# Altium project lora_tracker_altium.PrjPcb
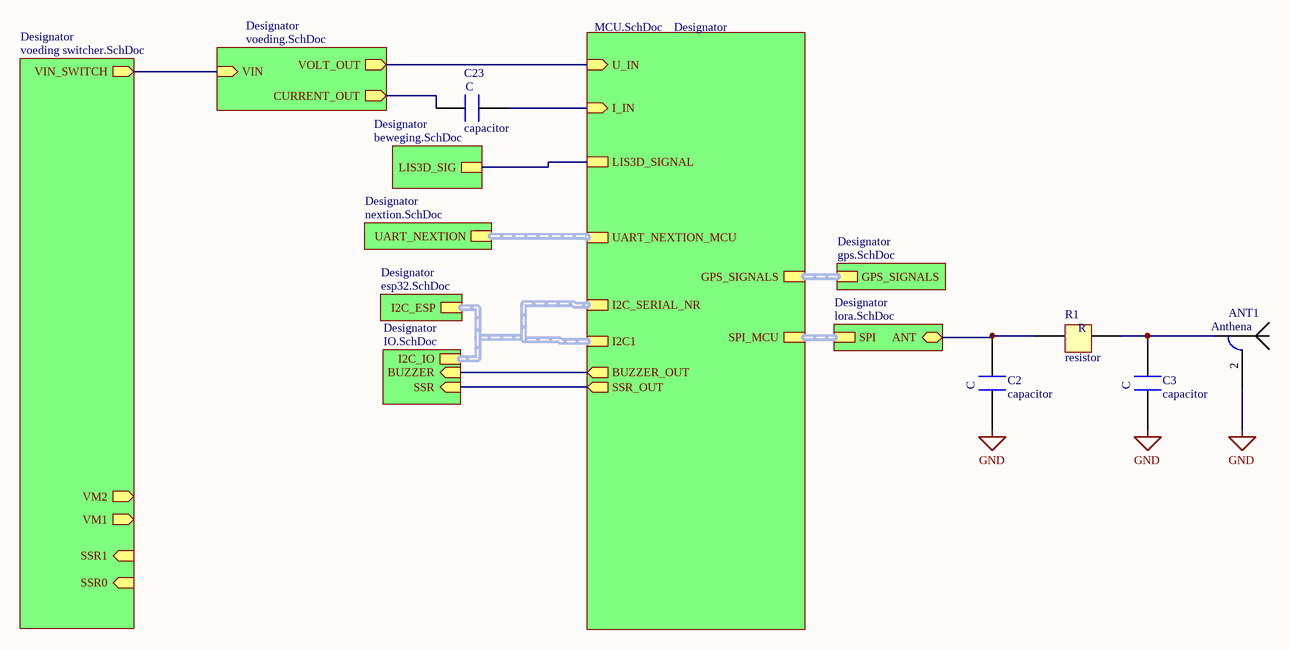
[diagram p0: top.SchDoc]
3 sheets, 21 parts. Net scope: hierarchical (ports join the sheet entries above them; power ports are global).
Board file: trackerpcb.PcbDoc
Sheets:
  top.SchDoc
    Designator = MCU.SchDoc
    Designator = voeding switcher.SchDoc

## Sheet top.SchDoc
size A4; Author: Ben De Lathouwer; CompanyName: Eurocircuits; DrawnBy: Ben De Lathouwer; SheetNumber: 1; SheetTotal: 8

### Parts
ANT1  Anthena  [sma connector]
C2  capacitor  [0603]
C3  capacitor  [0603]
C23  capacitor  [0603]
R1  resistor  [0603]

### Sub-sheets
Designator = voeding.SchDoc (file not in this document): VIN (in), VOLT_OUT (out), CURRENT_OUT (out)
Designator = beweging.SchDoc (file not in this document): LIS3D_SIG (harness LIS3D_SIGNAL)
Designator = IO.SchDoc (file not in this document): SSR (in), BUZZER (in), I2C_IO (harness I2C_SERIAL_NR)
Designator = gps.SchDoc (file not in this document): GPS_SIGNALS (harness GPS_SIGNALS)
Designator = esp32.SchDoc (file not in this document): I2C_ESP (harness I2C1)
Designator = lora.SchDoc (file not in this document): ANT (bidir), SPI (harness SPI)
Designator = nextion.SchDoc (file not in this document): UART_NEXTION (harness UART_NEXTION)
Designator = MCU.SchDoc: GPS_SIGNALS (harness GPS_SIGNALS), LIS3D_SIGNAL (harness LIS3D_SIGNAL), I2C_SERIAL_NR (harness I2C_SERIAL_NR), I2C1 (harness I2C1), SPI_MCU (harness SPI), UART_NEXTION_MCU (harness UART_NEXTION), I_IN (in), U_IN (in), SSR_OUT (out), BUZZER_OUT (out)
Designator = voeding switcher.SchDoc: VM2 (out), VM1 (out), SSR1 (in), SSR0 (in), VIN_SWITCH (out)

### Nets
GND: ANT1.2 C2.2 C3.2
Net*_4: sheet Designator/VIN, sheet Designator/VIN_SWITCH
NetANT1_1: ANT1.1 C3.1 R1.1
NetC2_1: C2.1 R1.2 ; sheet Designator/ANT
NetC23_1: C23.1 ; sheet Designator/I_IN
NetC23_2: C23.2 ; sheet Designator/CURRENT_OUT
NetU8_7: sheet Designator/VOLT_OUT, sheet Designator/U_IN
NetU8_14: sheet Designator/BUZZER, sheet Designator/BUZZER_OUT
NetU8_15: sheet Designator/SSR, sheet Designator/SSR_OUT

### Buses and harness runs
harness sheet Designator/I2C1 = sheet Designator/I2C_ESP = sheet Designator/I2C_IO = sheet Designator/I2C_SERIAL_NR
harness sheet Designator/SPI = sheet Designator/SPI_MCU
harness sheet Designator/UART_NEXTION = sheet Designator/UART_NEXTION_MCU

### Notes on the sheet
- (in symbol capacitor) C
- (in symbol resistor) R

## Sheet MCU.SchDoc
size A4; SheetNumber: 7; SheetTotal: 8
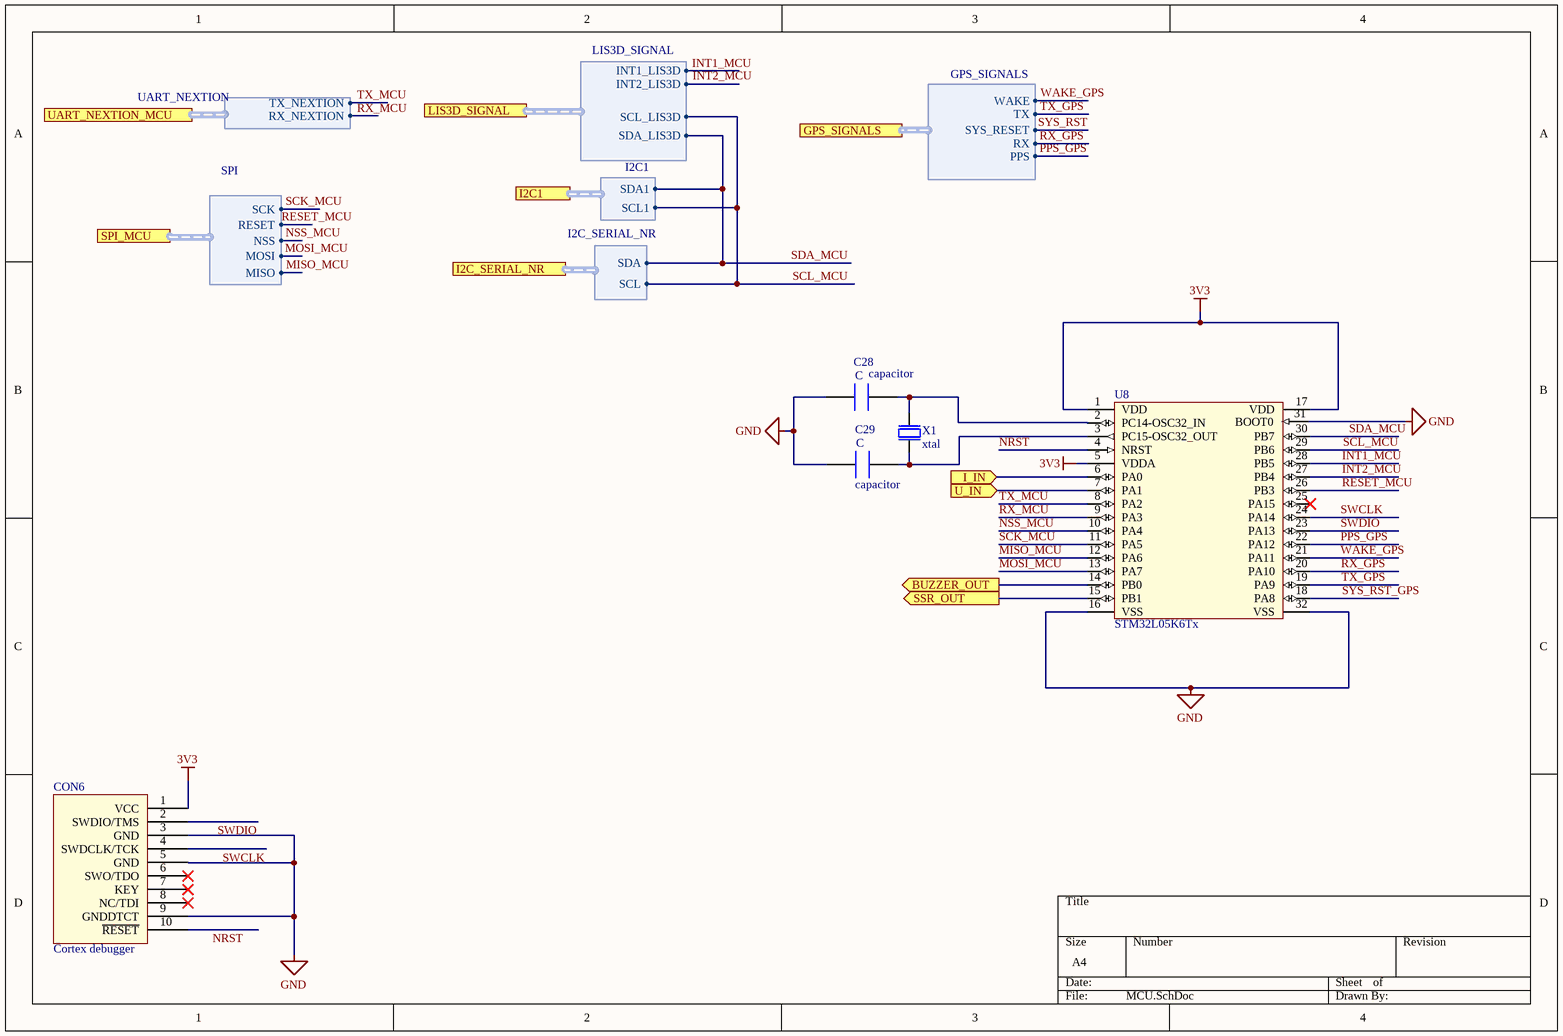
[diagram p1: MCU.SchDoc]

### Parts
C28  capacitor  [CAPC1005X04L]
C29  capacitor  [CAPC1005X04L]
CON6  Cortex debugger  [Jtag header]
U8  STM32L05K6Tx
X1  xtal  [BT-XTAL_2016]

### Ports
BUZZER_OUT (out), GPS_SIGNALS (harness GPS_SIGNALS), I2C1 (harness I2C1), I2C_SERIAL_NR (harness I2C_SERIAL_NR), I_IN (in), LIS3D_SIGNAL (harness LIS3D_SIGNAL), SPI_MCU (harness SPI), SSR_OUT (out), U_IN (in), UART_NEXTION_MCU (harness UART_NEXTION)

### Harnesses
UART_NEXTION: RX_NEXTION, TX_NEXTION
SPI: MISO, MOSI, NSS, RESET, SCK
LIS3D_SIGNAL: INT1_LIS3D, INT2_LIS3D, SCL_LIS3D, SDA_LIS3D
I2C1: SCL1, SDA1
I2C_SERIAL_NR: SCL, SDA
GPS_SIGNALS: PPS, RX, SYS_RESET, TX, WAKE

### Nets
3V3: CON6.1(VCC) U8.1(VDD) U8.5(VDDA) U8.17(VDD)
GND: C28.2 C29.2 CON6.3(GND) CON6.5(GND) CON6.9(GNDDTCT) U8.16(VSS) U8.31(BOOT0) U8.32(VSS)
INT1_MCU: U8.28(PB5)
INT2_MCU: U8.27(PB4) ; port LIS3D_SIGNAL.INT2_LIS3D
MISO_MCU: U8.12(PA6) ; port SPI_MCU.MISO
MOSI_MCU: U8.13(PA7) ; port SPI_MCU.MOSI
NRST: CON6.10(~{RESET}) U8.4(NRST)
NSS_MCU: U8.10(PA4) ; port SPI_MCU.NSS
PPS_GPS: U8.22(PA12) ; port GPS_SIGNALS.PPS
RESET_MCU: U8.26(PB3) ; port SPI_MCU.RESET
RX_GPS: U8.20(PA10) ; port GPS_SIGNALS.RX
RX_MCU: U8.9(PA3) ; harness UART_NEXTION.RX_NEXTION
SCK_MCU: U8.11(PA5) ; port SPI_MCU.SCK
SCL_MCU: U8.29(PB6) ; port LIS3D_SIGNAL.SCL_LIS3D, port I2C1.SCL1, port I2C1.SCL
SDA_MCU: U8.30(PB7) ; port LIS3D_SIGNAL.SDA_LIS3D, port I2C1.SDA1, port I2C1.SDA
SWCLK: CON6.4(SWDCLK/TCK) U8.24(PA14)
SWDIO: CON6.2(SWDIO/TMS) U8.23(PA13)
SYS_RST: port GPS_SIGNALS.SYS_RESET
SYS_RST_GPS: U8.18(PA8)
TX_GPS: U8.19(PA9) ; port GPS_SIGNALS.TX
TX_MCU: U8.8(PA2) ; harness UART_NEXTION.TX_NEXTION
WAKE_GPS: U8.21(PA11) ; port GPS_SIGNALS.WAKE
NetC23_1: U8.6(PA0) ; port I_IN
NetC28_1: C28.1 U8.2(PC14-OSC32_IN) X1.3(out)
NetC29_1: C29.1 U8.3(PC15-OSC32_OUT) X1.1(inp)
NetU8_7: U8.7(PA1) ; port U_IN
NetU8_14: U8.14(PB0) ; port BUZZER_OUT
NetU8_15: U8.15(PB1) ; port SSR_OUT

Not connected (* = marked no-connect by the designer): CON6 6(SWO/TDO)* 7(KEY)* 8(NC/TDI)*; U8 25(PA15)*

### Notes on the sheet
- Labels drawn without touching a wire or pin: INT1_MCU
- (in symbol capacitor) C

## Sheet voeding switcher.SchDoc
size A4; SheetNumber: 8; SheetTotal: 8
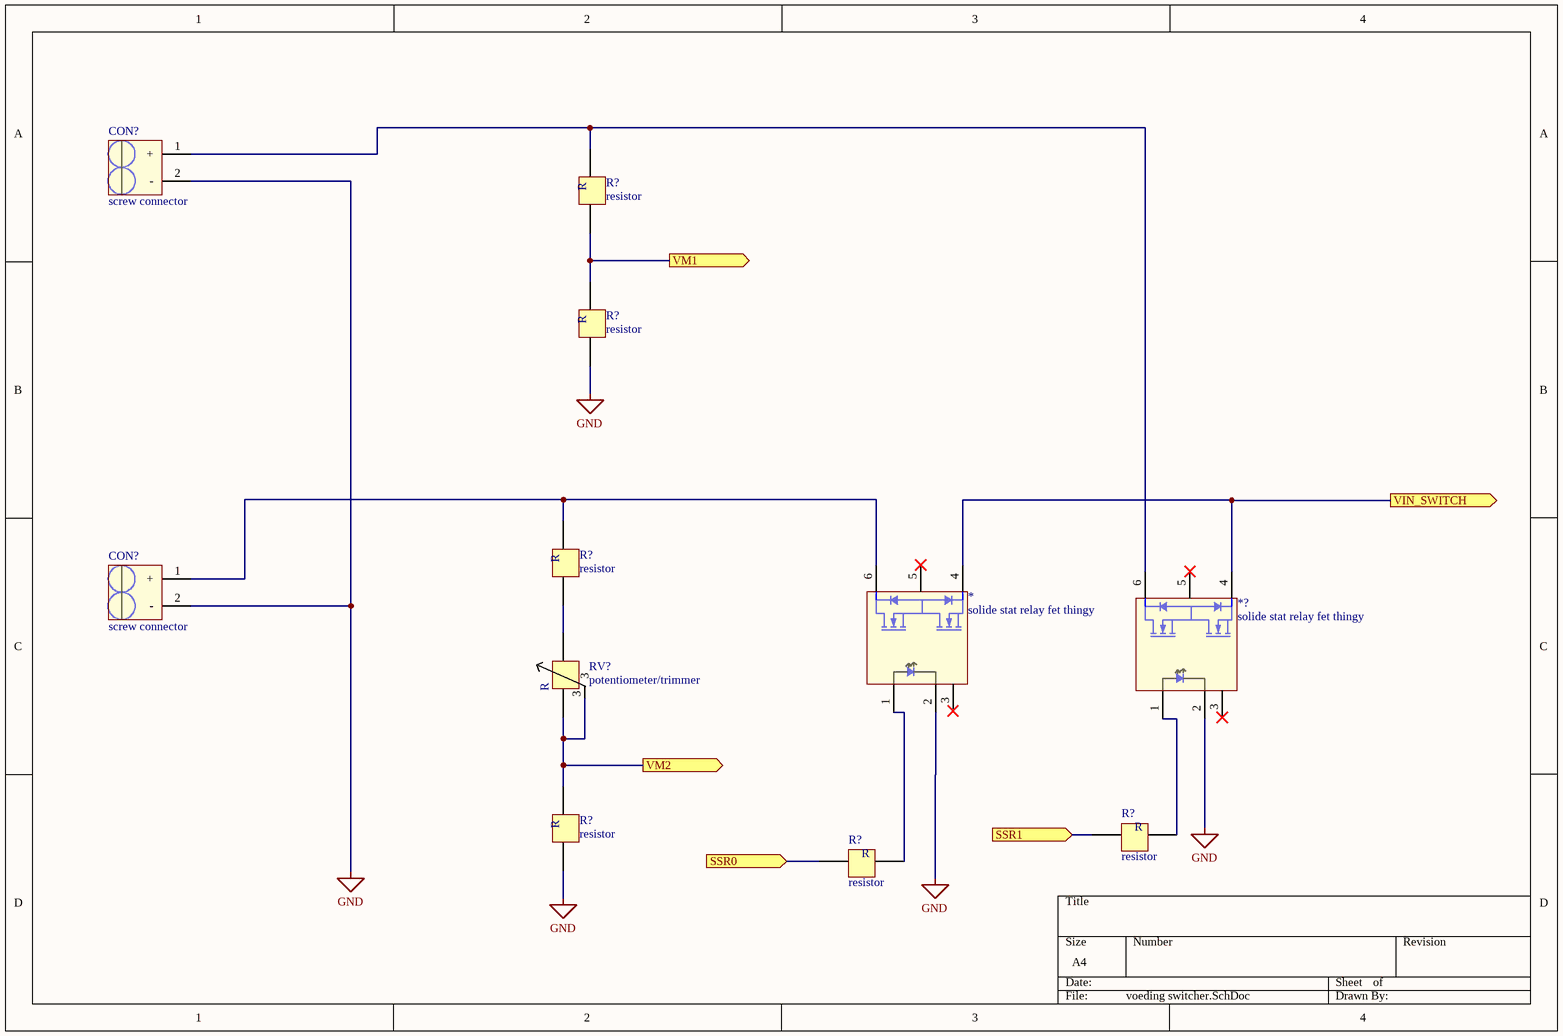
[diagram p2: voeding switcher.SchDoc]

### Parts
(Parts that share a designator on the sheet are numbered #1, #2 ... from top to bottom, then left to right.)
*  solide stat relay fet thingy
*?  solide stat relay fet thingy
CON?#1  screw connector
CON?#2  screw connector
R?#1  resistor  [CAPC1005X04L]
R?#2  resistor  [CAPC1005X04L]
R?#3  resistor  [CAPC1005X04L]
R?#4  resistor  [CAPC1005X04L]
R?#5  resistor  [CAPC1005X04L]
R?#6  resistor  [CAPC1005X04L]
RV?  potentiometer/trimmer

### Ports
SSR0 (in), SSR1 (in), VIN_SWITCH (out), VM1 (out), VM2 (out)

### Nets
GND: *.2 *?.2 CON?#1.2(-) CON?#2.2(-) R?#2.2 R?#4.2
Net*?_1: *?.1 R?#5.1
Net*?_6: *?.6 CON?#1.1(+) R?#1.1
Net*_1: *.1 R?#6.1
Net*_4: *.4 *?.4 ; port VIN_SWITCH
Net*_6: *.6 CON?#2.1(+) R?#3.1
NetR?#1_2: R?#1.2 R?#2.1 ; port VM1
NetR?#3_2: R?#3.2 RV?.1
NetR?#4_1: R?#4.1 RV?.2 RV?.3 ; port VM2
NetR?#5_2: R?#5.2 ; port SSR1
NetR?#6_2: R?#6.2 ; port SSR0

Not connected (* = marked no-connect by the designer): * 3* 5*; *? 3* 5*

### Notes on the sheet
- (in symbol potentiometer/trimmer) R
- (in symbol resistor) R

## Nets that join several sheets
GND: top (ANT1.2 C2.2 C3.2), MCU (8 pins), voeding switcher (6 pins)
NetC23_1: top (C23.1), MCU (U8.6)